# Altium schematic sheet BT612-4.SchDoc: SR4K_PHY6222_SIMPLIFY
size A2; Revision: V1.2; SheetNumber: 2; SheetTotal: 5
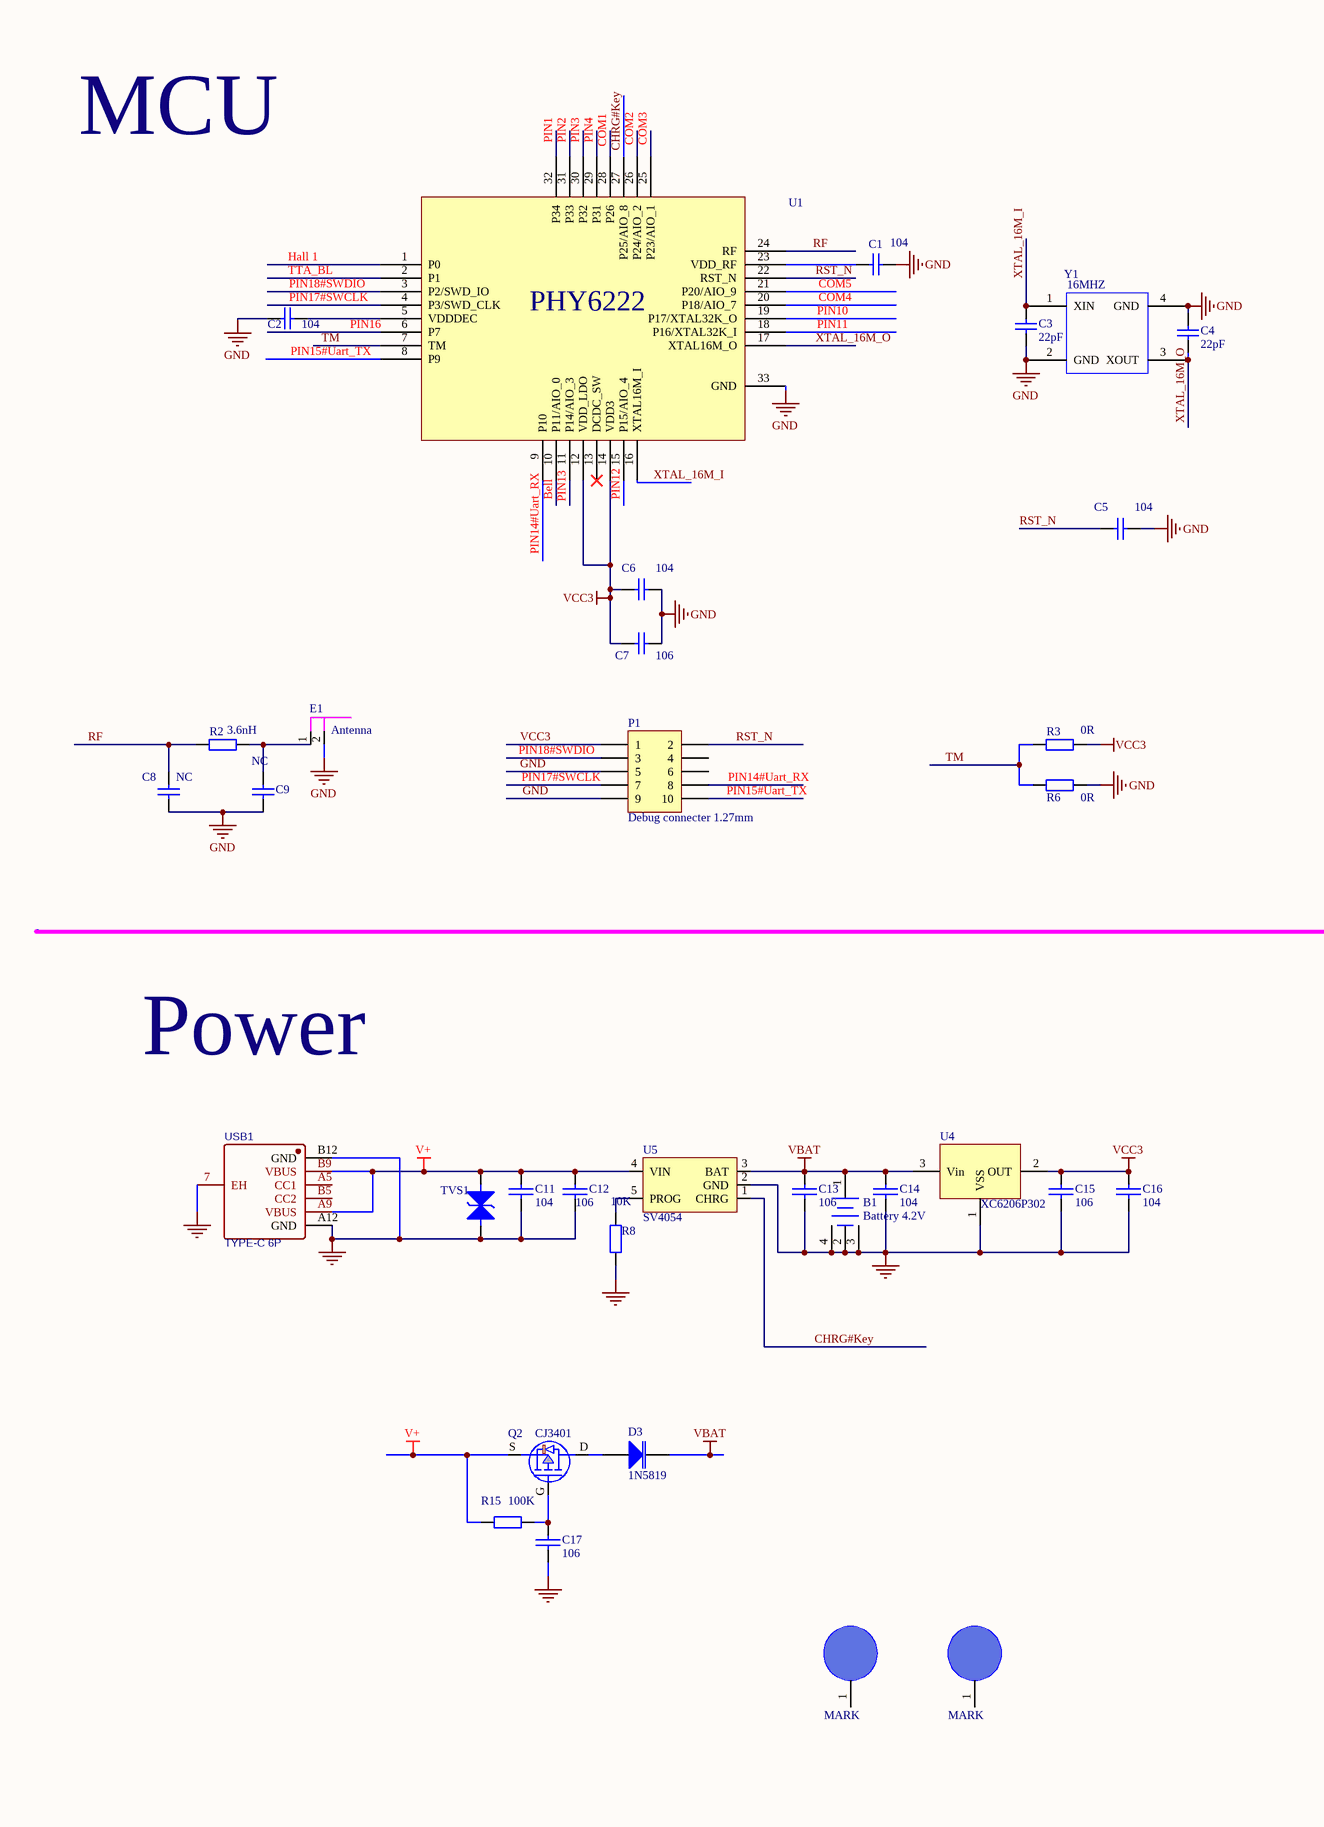
[diagram p0: BT612-4.SchDoc, left]
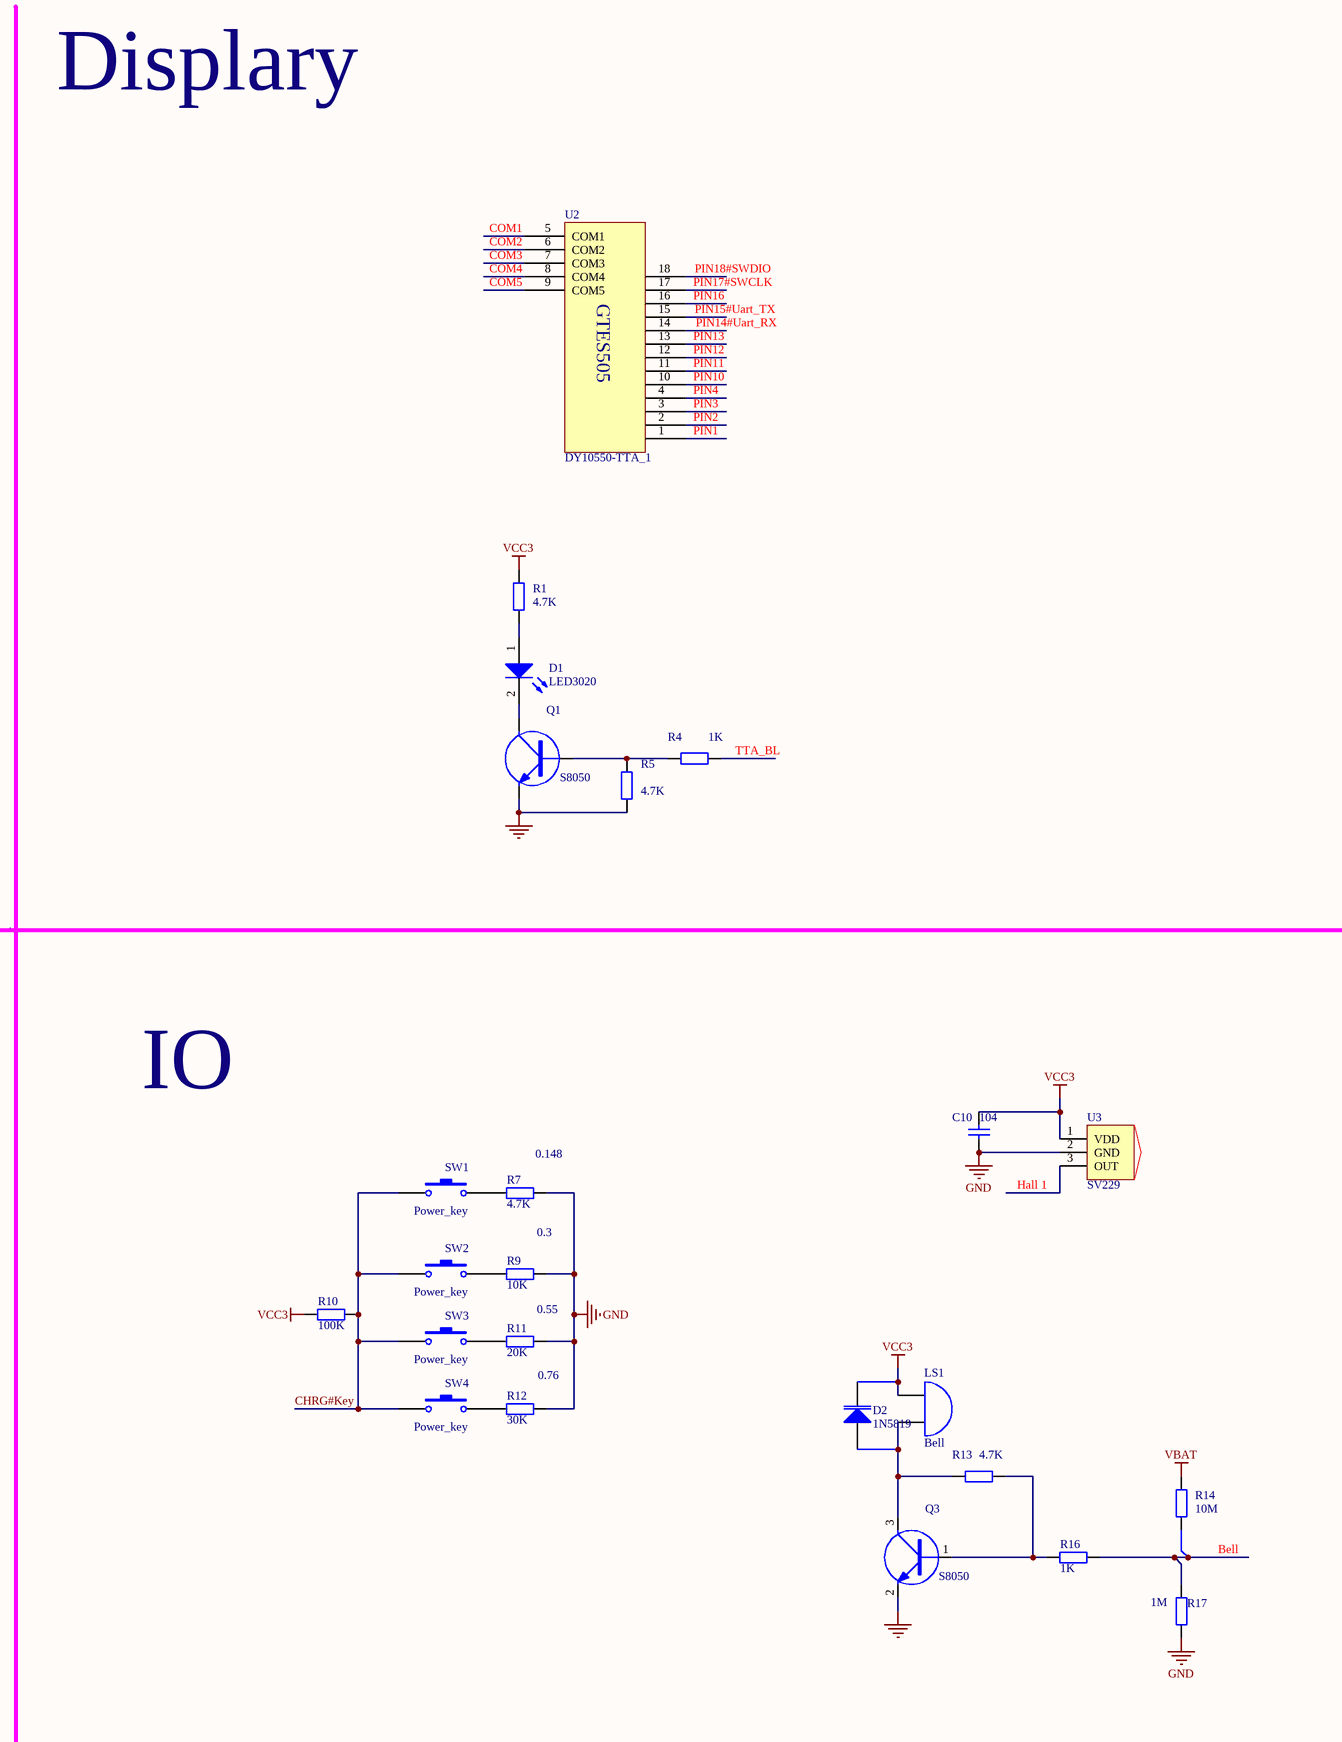
[diagram p1: BT612-4.SchDoc, right]

## Parts
B1  Battery 4.2V  [BAT2P-1.25]
C1  104  [0402C]
C2  104  [0402C]
C3  22pF  [0402C]
C4  22pF  [0402C]
C5  104  [0402C]
C6  104  [0402C]
C7  106  [0603-C]
C8  NC  [0402C]
C9  NC  [0402C]
C10  104  [0402C]
C11  104  [0402C]
C12  106  [0603-C]
C13  106  [0603-C]
C14  104  [0402C]
C15  106  [0603-C]
C16  104  [0402C]
C17  106  [0603-C]
D1  LED3020  [LED-3020]
D2  1N5819  [SOD323]
D3  1N5819  [SOD323]
E1  Antenna  [BT-ANT]
LS1  Bell  [BUZZ-12085]
P1  Debug connecter 1.27mm  [SIP5-X2-1.27]
Q1  S8050  [SOT23]
Q2  CJ3401  [SOT-23-GSD]
Q3  S8050  [SOT23]
R1  4.7K  [0402R]
R2  3.6nH  [0402R]
R3  0R  [0402R]
R4  1K  [0402R]
R5  4.7K  [0402R]
R6  0R  [0402R]
R7  4.7K  [0402R]
R8  10K  [0402R]
R9  10K  [0402R]
R10  100K  [0402R]
R11  20K  [0402R]
R12  30K  [0402R]
R13  4.7K  [0402R]
R14  10M  [0402R]
R15  100K  [0402R]
R16  1K  [0402R]
R17  1M  [0402R]
SW1  Power_key  [SW_PB_SMD_4X4]
SW2  Power_key  [SW_PB_SMD_4X4]
SW3  Power_key  [SW_PB_SMD_4X4]
SW4  Power_key  [SW_PB_SMD_4X4]
TP1  MARK  [MARK]
TP2  MARK  [MARK]
TVS1  TVS  [SOD323]  (value not drawn)
U1  PHY6222  [QFN32-4*4]  (value not drawn)
U2  DY10550-TTA_1  [GTES505液晶屏]
U3  SV229  [SOT23-3]
U4  XC6206P302  [SOT23]
U5  SV4054  [SOT23-5]
USB1  TYPE-C 6P  [TYPE-C 6P]
Y1  16MHZ  [JZ-3225]

## Nets
GND: B1.2(-) B1.3 B1.4 C1.2 C2.1 C3.2 C4.1 C5.2 C6.2 C7.2 C8.2 C9.2 C10.2 C11.1 C12.1 C13.1 C14.1 C15.1 C16.1 C17.1 E1.2 P1.5 P1.9 Q1.2(E) Q3.2(E) R5.1 R6.1 R7.2 R8.1 R9.2 R11.2 R12.2 R17.1 TVS1.1 U1.33(GND) U3.2(GND) U4.1(VSS) U5.2(GND) USB1.7(EH) USB1.A12(GND) USB1.B12(GND) Y1.2(GND) Y1.4(GND)
V+: C11.2 C12.2 Q2.S(SOURCE) R15.2 TVS1.2 U5.4(VIN) USB1.A9(VBUS) USB1.B9(VBUS)
VBAT: B1.1(+) C13.2 C14.2 D3.2 R14.2 U4.3(Vin) U5.3(BAT)
VCC3: C6.1 C7.1 C10.1 C15.2 C16.2 D2.2 LS1.1(A) P1.1 R1.2 R3.1 R10.1 U1.12(VDD_LDO) U1.14(VDD3) U3.1(VDD) U4.2(OUT)
Bell: R14.1 R16.2 R17.2 U1.10(P11/AIO_0)
CHRG#Key: R10.2 SW1.1 SW2.1 SW3.1 SW4.1 U1.27(P25/AIO_8) U5.1(CHRG)
COM1: U1.28(P26) U2.5(COM1)
COM2: U1.26(P24/AIO_2) U2.6(COM2)
COM3: U1.25(P23/AIO_1) U2.7(COM3)
COM4: U1.20(P18/AIO_7) U2.8(COM4)
COM5: U1.21(P20/AIO_9) U2.9(COM5)
Hall 1: U1.1(P0) U3.3(OUT)
PIN1: U1.32(P34) U2.1
PIN2: U1.31(P33) U2.2
PIN3: U1.30(P32) U2.3
PIN4: U1.29(P31) U2.4
PIN10: U1.19(P17/XTAL32K_O) U2.10
PIN11: U1.18(P16/XTAL32K_I) U2.11
PIN12: U1.15(P15/AIO_4) U2.12
PIN13: U1.11(P14/AIO_3) U2.13
PIN14#Uart_RX: P1.8 U1.9(P10) U2.14
PIN15#Uart_TX: P1.10 U1.8(P9) U2.15
PIN16: U1.6(P7) U2.16
PIN17#SWCLK: P1.7 U1.4(P3/SWD_CLK) U2.17
PIN18#SWDIO: P1.3 U1.3(P2/SWD_IO) U2.18
RF: C8.1 R2.2 U1.24(RF)
RST_N: C5.1 P1.2 U1.22(RST_N)
TM: R3.2 R6.2 U1.7(TM)
TTA_BL: R4.2 U1.2(P1)
XTAL_16M_I: C3.1 U1.16(XTAL16M_I) Y1.1(XIN)
XTAL_16M_O: C4.2 U1.17(XTAL16M_O) Y1.3(XOUT)
NetC1_1: C1.1 U1.23(VDD_RF)
NetC2_2: C2.2 U1.5(VDDDEC)
NetC9_1: C9.1 E1.1 R2.1
NetC17_2: C17.2 Q2.G(GATE) R15.1
NetD1_1: D1.1(A) R1.1
NetD1_2: D1.2(K) Q1.3(C)
NetD2_1: D2.1 LS1.2(B) Q3.3(C) R13.2
NetD3_1: D3.1 Q2.D(DRAIN)
NetQ1_1: Q1.1(B) R4.1 R5.2
NetQ3_1: Q3.1(B) R13.1 R16.1
NetR7_1: R7.1 SW1.2
NetR8_2: R8.2 U5.5(PROG)
NetR9_1: R9.1 SW2.2
NetR11_1: R11.1 SW3.2
NetR12_1: R12.1 SW4.2

Not connected (* = marked no-connect by the designer): P1 4 6; TP1 1; TP2 1; U1 13(DCDC_SW)*; USB1 A5(CC1) B5(CC2)

## Notes on the sheet
- MCU
- Displary
- Power
- IO
- (near R7) 0.148
- 0.3
- 0.55
- 0.76
- Title
- Size:
- Date:
- A4
- Number:
- Time:
- Revision:
- Sheet
- emmovo@outlook.com
- of
- File:
- (in symbol DY10550-TTA_1) GTES505

## Library data of the parts
B1 = Battery: Multicell Battery; Published: 24-Mar-1999; LatestRevisionDate: 17-Jul-2002; LatestRevisionNote: Re-released for DXP Platform.; PackageReference: BAT-2; Publisher: Altium Limited; PackageDescription: Battery; 2 Leads
C1 = Cap: Capacitor; Value: 2.2uF; Published: 8-Jun-2000; LatestRevisionDate: 17-Jul-2002; LatestRevisionNote: Re-released for DXP Platform.; PackageReference: RAD-0.3; Publisher: Altium Limited; PackageDescription: Radial Cap, Thru-Hole; 2 Leads; 0.3 in Pin Spacing
C2 = Cap: Capacitor; Value: 100pF; Published: 8-Jun-2000; LatestRevisionDate: 17-Jul-2002; LatestRevisionNote: Re-released for DXP Platform.; PackageReference: RAD-0.3; Publisher: Altium Limited; PackageDescription: Radial Cap, Thru-Hole; 2 Leads; 0.3 in Pin Spacing
C3 C4 C8 C9 = Cap: Capacitor
  C3: Published: 8-Jun-2000; LatestRevisionDate: 17-Jul-2002; LatestRevisionNote: Re-released for DXP Platform.; PackageReference: RAD-0.3; Publisher: Altium Limited; PackageDescription: Radial Cap, Thru-Hole; 2 Leads; 0.3 in Pin Spacing; Value: 22pF
  C8 C9: Published: 8-Jun-2000; LatestRevisionDate: 17-Jul-2002; LatestRevisionNote: Re-released for DXP Platform.; PackageReference: RAD-0.3; Publisher: Altium Limited; PackageDescription: Radial Cap, Thru-Hole; 2 Leads; 0.3 in Pin Spacing; Value: NC
C5 = Cap: Capacitor; Value: 1uF; Published: 8-Jun-2000; LatestRevisionDate: 17-Jul-2002; LatestRevisionNote: Re-released for DXP Platform.; PackageReference: RAD-0.3; Publisher: Altium Limited; PackageDescription: Radial Cap, Thru-Hole; 2 Leads; 0.3 in Pin Spacing
C6 = Cap: Capacitor; Value: 0.1uF; Published: 8-Jun-2000; LatestRevisionDate: 17-Jul-2002; LatestRevisionNote: Re-released for DXP Platform.; PackageReference: RAD-0.3; Publisher: Altium Limited; PackageDescription: Radial Cap, Thru-Hole; 2 Leads; 0.3 in Pin Spacing
C7 = Cap: Capacitor; Value: 10nF; Published: 8-Jun-2000; LatestRevisionDate: 17-Jul-2002; LatestRevisionNote: Re-released for DXP Platform.; PackageReference: RAD-0.3; Publisher: Altium Limited; PackageDescription: Radial Cap, Thru-Hole; 2 Leads; 0.3 in Pin Spacing
C10 = Cap: Capacitor; Value: 100nF; Published: 8-Jun-2000; LatestRevisionDate: 17-Jul-2002; LatestRevisionNote: Re-released for DXP Platform.; PackageReference: RAD-0.3; Publisher: Altium Limited; PackageDescription: Radial Cap, Thru-Hole; 2 Leads; 0.3 in Pin Spacing
C11-C17 = CAP: Capacitor
D1 = LED0: Typical INFRARED GaAs LED; Published: 8-Jun-2000; LatestRevisionDate: 08-Jul-2005; LatestRevisionNote: Mech Layer 1 removed.; PackageReference: LED-0; Publisher: Altium Limited; PackageDescription: LED; 2 Leads
D2 D3 = D Varactor: Variable Capacitance Diode; Note: Pin 2 is not connected and not drawn.; Published: 8-Jun-2000; LatestRevisionDate: 29-May-2009; LatestRevisionNote: IPC-7351 Footprint Added.; DatasheetVersion: Jan-1998; PackageVersion: 1996; PackageReference: SOT23A; Publisher: Altium Limited; PackageDescription: 3-Pin SOT-23 Package 0.95 mm Pitch, 2.3 mm Lead Span - Reverse Pinning; ComponentLink1Description: Manufacturer Link; ComponentLink1URL: http://www.zetex.com/
LS1 = Bell: Electrical Bell; Published: 24-Mar-1999; LatestRevisionDate: 17-Jul-2002; LatestRevisionNote: Re-released for DXP Platform.; PackageReference: PIN2; Publisher: Altium Limited
P1 = Header 5X2: Header, 5-Pin, Dual row; LatestRevisionDate: 17-Jul-2002; LatestRevisionNote: Re-released for DXP Platform.; Publisher: Altium Limited
Q1 Q3 = NPN: NPN Transistor
Q2 = P-MOS
R1 R4 R5 R9-R14 R16 R17 = Res2: Resistor; Published: 8-Jun-2000; LatestRevisionDate: 17-Jul-2002; LatestRevisionNote: Re-released for DXP Platform.; PackageReference: AXIAL-0.4; Publisher: Altium Limited; PackageDescription: Axial Device, Thru-Hole; 2 Leads; 0.4 in Pin Spacing
  R1 R5 R13: Value: 4.7K
  R4 R16: Value: 1K
  R9: Value: 10K
  R10: Value: 100K
  R11: Value: 20K
  R12: Value: 30K
  R14: Value: 10M
  R17: Value: 1M
R2 R3 R6 = Res2: Resistor; Value: 0; Published: 8-Jun-2000; LatestRevisionDate: 17-Jul-2002; LatestRevisionNote: Re-released for DXP Platform.; PackageReference: AXIAL-0.4; Publisher: Altium Limited; PackageDescription: Axial Device, Thru-Hole; 2 Leads; 0.4 in Pin Spacing
R7 = Res2: Resistor; Value: 5K; Published: 8-Jun-2000; LatestRevisionDate: 17-Jul-2002; LatestRevisionNote: Re-released for DXP Platform.; PackageReference: AXIAL-0.4; Publisher: Altium Limited; PackageDescription: Axial Device, Thru-Hole; 2 Leads; 0.4 in Pin Spacing
R8 R15 = Res2: 1%@100mA; Published: 8-Jun-2000; LatestRevisionDate: 17-Jul-2002; LatestRevisionNote: Re-released for DXP Platform.; PackageReference: AXIAL-0.4; Publisher: Altium Limited; PackageDescription: Axial Device, Thru-Hole; 2 Leads; 0.4 in Pin Spacing
  R8: Value: 10K
  R15: Value: 100K
SW1-SW4 = SW-PB: Switch; Published: 24-Mar-1999; LatestRevisionDate: 17-Jul-2002; LatestRevisionNote: Re-released for DXP Platform.; PackageReference: SPST-2; Publisher: Altium Limited
TP1 TP2 = TP
U3 = 霍尔44E 938
USB1 = TYPE-C 6P: BOM_Manufacturer: SHOU HAN; Contributor: LCSC; BOM_Supplier: LCSC; BOM_Supplier Part: C456012; BOM_Manufacturer Part: TYPE-C 6P; BOM_JLCPCB Part Class: Extended Part; spicePre: U; spiceSymbolName: TYPE-C 6P
Y1 = X1_1: PCB DECAL: 3225; Source_Path: E:\LI LELE\DESIGN KIT\DESIGN KIT_ESP8089_DEMO\ESP8089_DEMO.DSN; Value: 40MHz+/-10ppm